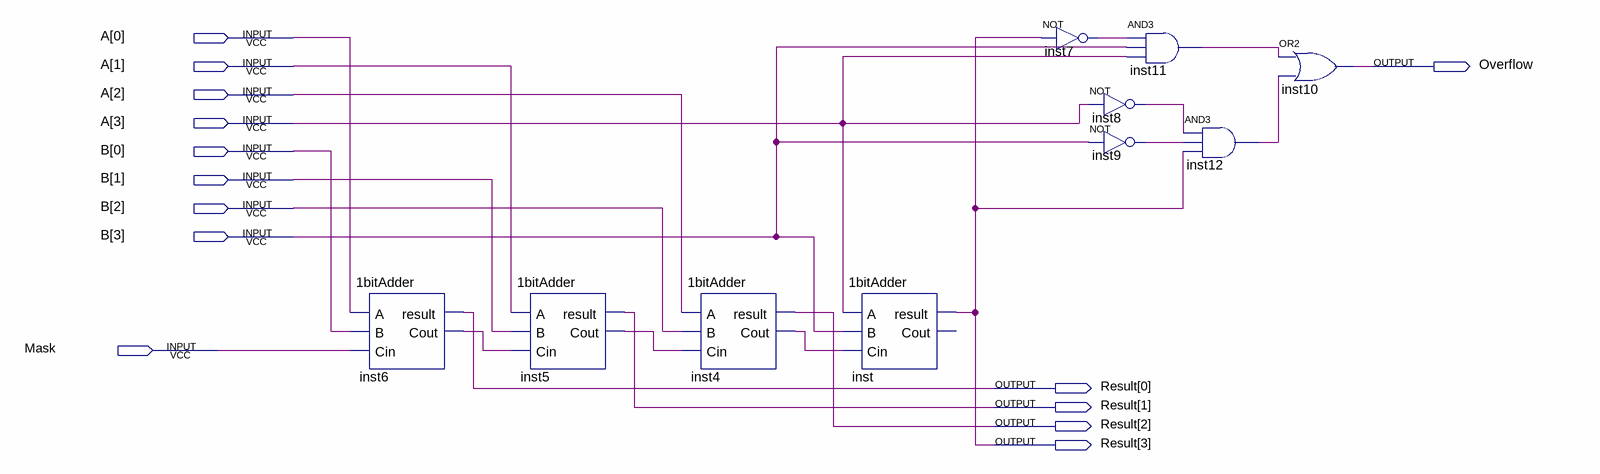
[diagram p0: schematic sheet]
// Quartus schematic 4BitAdder.bdf as structural Verilog: 10 symbols, 14 pins
module \4BitAdder  (
  input  [3:0] A,
  input  [3:0] B,
  input  Mask,
  output Overflow,
  output [3:0] Result
);

  wire inst4_cout, inst5_cout, inst6_cout, inst7_out, inst8_out, inst9_out, inst11_out, inst12_out;

  \1bitAdder  inst6 (.A(A[0]), .B(B[0]), .Cin(Mask), .result(Result[0]), .Cout(inst6_cout));
  \1bitAdder  inst5 (.A(A[1]), .B(B[1]), .Cin(inst6_cout), .result(Result[1]), .Cout(inst5_cout));
  \1bitAdder  inst4 (.A(A[2]), .B(B[2]), .Cin(inst5_cout), .result(Result[2]), .Cout(inst4_cout));
  \1bitAdder  inst (.A(A[3]), .B(B[3]), .Cin(inst4_cout), .result(Result[3]));  // open: Cout
  not inst7 (inst7_out, Result[3]);
  not inst8 (inst8_out, A[3]);
  not inst9 (inst9_out, B[3]);
  and inst11 (inst11_out, inst7_out, B[3], A[3]);
  and inst12 (inst12_out, inst8_out, inst9_out, Result[3]);
  or inst10 (Overflow, inst11_out, inst12_out);
endmodule
